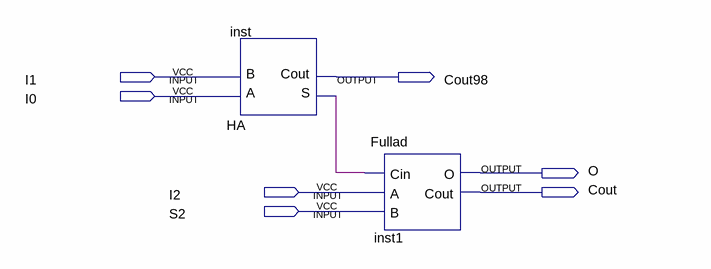
[diagram p0: schematic sheet]
// Quartus schematic B4.bdf as structural Verilog: 2 symbols, 7 pins
module B4 (
  input  I1,
  input  I0,
  input  I2,
  input  S2,
  output Cout98,
  output O,
  output Cout
);

  wire inst_s;

  HA inst (.A(I0), .B(I1), .S(inst_s), .Cout(Cout98));
  Fullad inst1 (.Cin(inst_s), .A(I2), .B(S2), .O(O), .Cout(Cout));
endmodule
